# Altium project 基于单片机的空调温度控制系统.PrjPCB
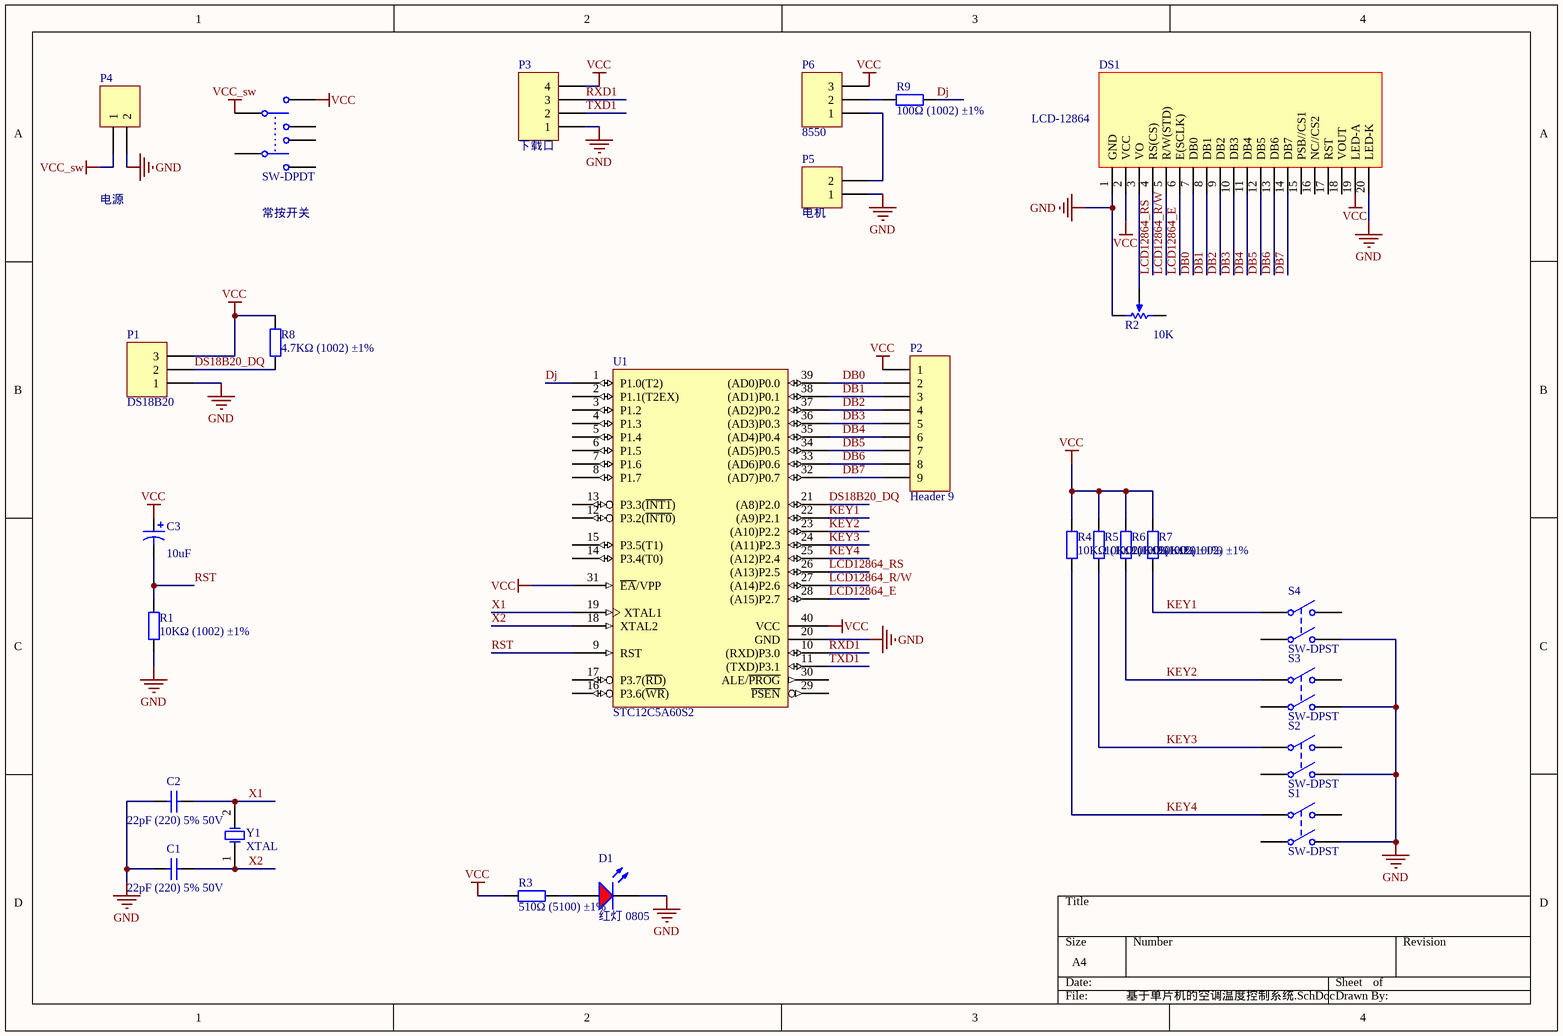
[diagram p0: 基于单片机的空调温度控制系统.SchDoc]
1 sheet, 27 parts. Net scope: global (net labels, ports and power ports of the same name join across sheets).
Board file: 基于单片机的空调温度控制系统.PcbDoc

## Sheet 基于单片机的空调温度控制系统.SchDoc
size A4

### Parts
C1  22pF (220) 5% 50V  [LC-0805_C]
C2  22pF (220) 5% 50V  [LC-0805_C]
C3  value 10uF  [RB.2.5/.6.3mm]  (hidden comment: Cap Pol1)
D1  红灯 0805  [LC-0805_LED_S1]
DS1  LCD-12864  [LCD-12864]
P1  DS18B20  [HDR1X3]
P2  Header 9  [HDR1X9]
P3  下载口  [HDR1X4]
P4  电源  [DC插座]
P5  电机  [HDR1X2]
P6  8550  [HDR1X3]
R1  10KΩ (1002) ±1%  [LC-0805_R]
R2  value 10K  [VR5]  (hidden comment: Pot)
R3  510Ω (5100) ±1%  [LC-0805_R]
R4  10KΩ (1002) ±1%  [LC-0805_R]
R5  10KΩ (1002) ±1%  [LC-0805_R]
R6  10KΩ (1002) ±1%  [LC-0805_R]
R7  10KΩ (1002) ±1%  [LC-0805_R]
R8  4.7KΩ (1002) ±1%  [LC-0805_R]
R9  100Ω (1002) ±1%  [LC-0805_R]
S1  SW-DPST  [Switch6*6]
S2  SW-DPST  [Switch6*6]
S3  SW-DPST  [Switch6*6]
S4  SW-DPST  [Switch6*6]
U1  STC12C5A60S2  [DIP40]
Y1  XTAL  [XTAL]
常按开关  SW-DPDT  [DPDT-6]

### Nets
GND: C1.1 C2.1 D1.K DS1.1(GND) DS1.20(LED-K) P1.1 P3.1 P4.2 P5.1 R1.1 R2.2(BOT) S1.4(NO2) S2.4(NO2) S3.4(NO2) S4.4(NO2) U1.20(GND)
VCC: C3.1 DS1.2(VCC) DS1.19(LED-A) P1.3 P2.1 P3.4 P6.3 R3.1 R4.2 R5.2 R6.2 R7.2 R8.2 U1.31(~{EA}/VPP) U1.40(VCC) 常按开关.2
VCC_sw: P4.1 常按开关.1
DB0: DS1.7(DB0) P2.2 U1.39((AD0)P0.0)
DB1: DS1.8(DB1) P2.3 U1.38((AD1)P0.1)
DB2: DS1.9(DB2) P2.4 U1.37((AD2)P0.2)
DB3: DS1.10(DB3) P2.5 U1.36((AD3)P0.3)
DB4: DS1.11(DB4) P2.6 U1.35((AD4)P0.4)
DB5: DS1.12(DB5) P2.7 U1.34((AD5)P0.5)
DB6: DS1.13(DB6) P2.8 U1.33((AD6)P0.6)
DB7: DS1.14(DB7) P2.9 U1.32((AD7)P0.7)
Dj: R9.1 U1.1(P1.0(T2))
DS18B20_DQ: P1.2 R8.1 U1.21((A8)P2.0)
KEY1: R7.1 S4.1(COMMON1) U1.22((A9)P2.1)
KEY2: R6.1 S3.1(COMMON1) U1.23((A10)P2.2)
KEY3: R5.1 S2.1(COMMON1) U1.24((A11)P2.3)
KEY4: R4.1 S1.1(COMMON1) U1.25((A12)P2.4)
LCD12864_E: DS1.6(E(SCLK)) U1.28((A15)P2.7)
LCD12864_R/W: DS1.5(R/W(STD)) U1.27((A14)P2.6)
LCD12864_RS: DS1.4(RS(CS)) U1.26((A13)P2.5)
RST: C3.2 R1.2 U1.9(RST)
RXD1: P3.3 U1.10((RXD)P3.0)
TXD1: P3.2 U1.11((TXD)P3.1)
X1: C2.2 U1.19(XTAL1) Y1.2(OSC2)
X2: C1.2 U1.18(XTAL2) Y1.1(OSC1)
NetD1_A: D1.A R3.2
NetDS1_3: DS1.3(VO) R2.3(TAP)
NetP5_2: P5.2 P6.1
NetP6_2: P6.2 R9.2

Not connected (* = marked no-connect by the designer): DS1 15(PSB//CS1) 16(NC//CS2) 17(RST) 18(VOUT); R2 1(TOP); S1 2(NO1) 3(COMMON2); S2 2(NO1) 3(COMMON2); S3 2(NO1) 3(COMMON2); S4 2(NO1) 3(COMMON2); U1 2(P1.1(T2EX)) 3(P1.2) 4(P1.3) 5(P1.4) 6(P1.5) 7(P1.6) 8(P1.7) 12(P3.2(~{INT0})) 13(P3.3(~{INT1})) 14(P3.4(T0)) 15(P3.5(T1)) 16(P3.6(~{WR})) 17(P3.7(~{RD})) 29(~{PSEN}) 30(ALE/~{PROG}); 常按开关 3 4 5 6

### Library data of the parts
C1 C2 = 0805 22pF (220) 5% 50V: 贴片电容; ComponentLink1Description: 供应商链接; ComponentLink1URL: http://www.szlcsc.com/product/details_2156.html; Package: 0805; Supplier: LC; SuppliersPartNumber: C1804
C3 = Cap Pol1: Polarized Capacitor (Radial); Published: 8-Jun-2000; LatestRevisionDate: 17-Jul-2002; LatestRevisionNote: Re-released for DXP Platform.; PackageReference: RB7.6-15; Publisher: Altium Limited; PackageDescription: Polarized Capacitor (Radial); 2 Leads
D1 = 0805 红灯: 发光二极管; ComponentLink1Description: 供应商链接; ComponentLink1URL: http://www.szlcsc.com/product/details_2668.html; Package: 0805; Supplier: LC; SuppliersPartNumber: C2295
DS1 = LCD-12864: 带//不带字库
P1 P6 = Header 3: Header, 3-Pin; LatestRevisionDate: 17-Jul-2002; LatestRevisionNote: Re-released for DXP Platform.; Publisher: Altium Limited
P2 = Header 9: Header, 9-Pin; LatestRevisionDate: 17-Jul-2002; LatestRevisionNote: Re-released for DXP Platform.; Publisher: Altium Limited
P3 = Header 4: Header, 4-Pin; LatestRevisionDate: 17-Jul-2002; LatestRevisionNote: Re-released for DXP Platform.; Publisher: Altium Limited
P4 P5 = Header 2: Header, 2-Pin; LatestRevisionDate: 17-Jul-2002; LatestRevisionNote: Re-released for DXP Platform.; Publisher: Altium Limited
R1 R4-R9 = 0805 10KΩ (1002) 1%: 贴片电阻; ComponentLink1Description: 供应商链接; ComponentLink1URL: http://www.szlcsc.com/product/details_18102.html; Package: 0805; Supplier: LC; SuppliersPartNumber: C17414
R2 = RPot: Potentiometer; Sim Note: Enter the Resistance value and the set point into parameter fields.; Set Position: 0.5; Published: 8-Jun-2000; LatestRevisionDate: 17-Jul-2002; LatestRevisionNote: Re-released for DXP Platform.; PackageReference: VR5; Publisher: Altium Limited; PackageDescription: Variable Resistor, Thru-Hole; 3 Leads
R3 = 0805 510Ω (5100) 1%: 贴片电阻; ComponentLink1Description: 供应商链接; ComponentLink1URL: http://www.szlcsc.com/product/details_18422.html; Package: 0805; Supplier: LC; SuppliersPartNumber: C17734
S1-S4 = SW-DPST: Double-Pole, Single-Throw Switch; Published: 24-Mar-1999; LatestRevisionDate: 17-Jul-2002; LatestRevisionNote: Re-released for DXP Platform.; PackageReference: DPST-4; Publisher: Altium Limited; PackageDescription: Switch; 4 Leads
U1 = AT89C52: 8-Bit Microcontroller with 8K Flash ROM
Y1 = XTAL: Crystal Oscillator; Published: 8-Jun-2000; LatestRevisionDate: 17-Jul-2002; LatestRevisionNote: Re-released for DXP Platform.; PackageReference: R38; Publisher: Altium Limited; PackageDescription: Crystal, Thru-Hole; 2 Leads; Body 3.1 x 8.2 mm (Dia.xH)
常按开关 = SW-DPDT: Double-Pole, Double-Throw Switch; Published: 24-Mar-1999; LatestRevisionDate: 17-Jul-2002; LatestRevisionNote: Re-released for DXP Platform.; PackageReference: DPDT-6; Publisher: Altium Limited; PackageDescription: Switch; 6 Leads